# Altium schematic sheet 3V3_PSU.SchDoc
size A4
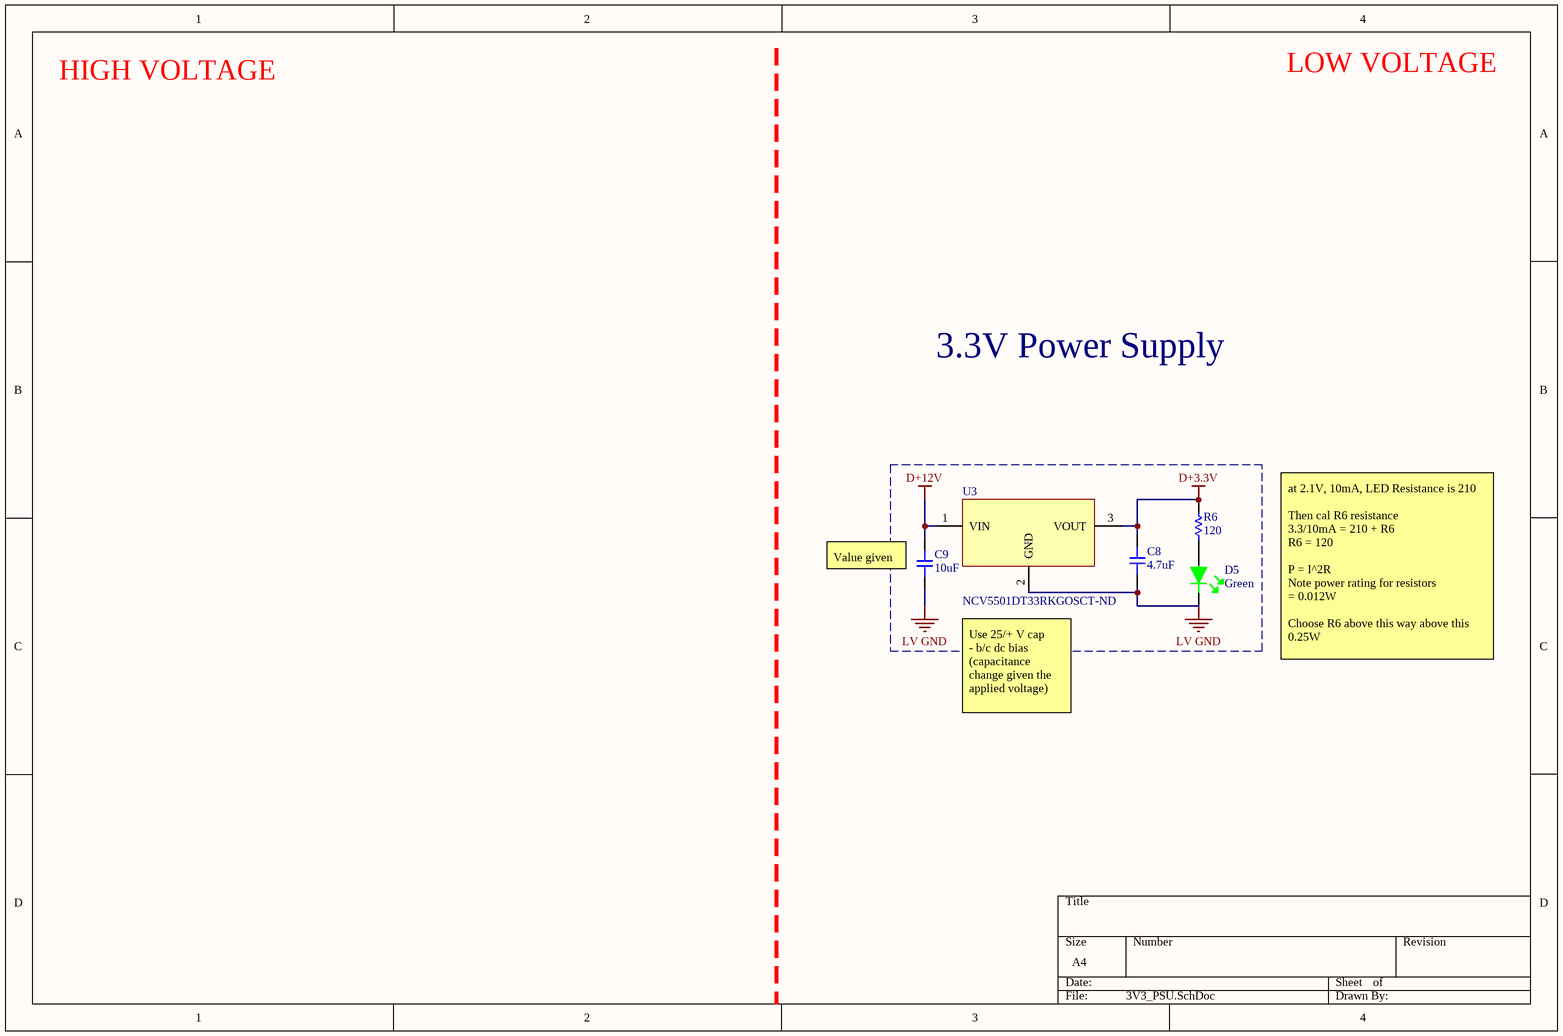
[diagram p0: 3V3_PSU.SchDoc]

## Parts
C8  4.7uF  [CAP-0805]
C9  10uF  [CAP-1206]
D5  Green  [LED-0603]
R6  120  [RESC1608X06N]
U3  NCV5501DT33RKGOSCT-ND  [DPAK-TO252]

## Nets
D+3.3V: C8.2 R6.2 U3.3(VOUT)
D+12V: C9.2 U3.1(VIN)
LV GND: C8.1 C9.1 D5.2 U3.2(GND)
NetD5_1: D5.1 R6.1

## Notes on the sheet
- HIGH VOLTAGE
- LOW VOLTAGE
- 3.3V Power Supply
- (near C9) Value given
- at 2.1V, 10mA, LED Resistance is 210
  Then cal R6 resistance
  3.3/10mA = 210 + R6
  R6 = 120
  P = I^2R
  Note power rating for resistors
  = 0.012W
  Choose R6 above this way above this
  0.25W
- Use 25/+ V cap
  - b/c dc bias (capacitance change given the applied voltage)

## Library data of the parts
C8 = 0805-4.7uF-16V: CAP CER 4.7UF 16V X5R 0805; Manufacturer: KEMET; Manufacturer Part Number: C0805C475K4PACTU; Dielectric Material: Ceramic; Tolerance: 10%; Supplier 1: Digi-Key; Stock 1: 96594; Pricing 1: 1=0.24, 10=0.168, 100=0.0951, 500=0.0671, 1000=0.05872 (USD); Mount: Surface Mount; Case/Package: 0805; Min Operating Temperature: -55°C; Max Operating Temperature: 85°C; Capacitance: 4.7uF; Packaging: Tape and Reel; Dielectric: X5R; Voltage: 16V; Termination: SMD/SMT; Voltage Rating (DC): 16V; Length: 2mm; Height: 1.25mm; Depth: 1.25mm; Radiation Hardening: No; Lead Free: Lead Free; ComponentLink1URL: http://capacitoredge.kemet.com/capedge2/DataSheet?pn=C0805C475K4PAC7800&src-supplier=Avnet+Europe; ComponentLink1Description: http://capacitoredge.kemet.com/capedge2/DataSheet?pn=C0805C475K4PAC7800&src-supplier=Avnet+Europe; ComponentLink2URL: https://www.verical.com/server-webapp/html/getDatasheet?partID=319476&src-supplier=Verical; ComponentLink2Description: https://www.verical.com/server-webapp/html/getDatasheet?partID=319476&src-supplier=Verical; Supplier Part Number 1: 399-8101-6-ND
C9 = 1206-10uF-50V: CAP CER 10UF 50V X5R 1206; Manufacturer: Murata; Manufacturer Part Number: GRT31CR61H106ME01L; Tolerance: 20%; Supplier 1: Digi-Key; Stock 1: 247205; Pricing 1: 1=0.5, 10=0.349, 100=0.2092, 500=0.1569, 1000=0.13249 (USD); Mount: Surface Mount; Case/Package: 1206; Case Code (Metric): 3216; Case Code (Imperial): 1206; Min Operating Temperature: -55°C; Max Operating Temperature: 85°C; Packaging: Tape and Reel; Capacitance: 10uF; Voltage Rating: 50V; Length: 0.126inch; Width: 0.063inch; Thickness: 0.071inch; Ratings: AEC-Q200; ComponentLink1URL: http://search.murata.co.jp/Ceramy/image/img/A01X/G101/ENG/GRT31CR61H106ME01-01.pdf?src-supplier=Digi-Key; ComponentLink1Description: http://search.murata.co.jp/Ceramy/image/img/A01X/G101/ENG/GRT31CR61H106ME01-01.pdf?src-supplier=Digi-Key; Supplier Part Number 1: 490-12457-1-ND
D5 = LED-Green: LED GREEN CLEAR 0603 SMD; Manufacturer: Wurth Electronics; Manufacturer Part Number: 150060VS75000; Luminous Intensity: 40mcd; Viewing Angle: 140°; Forward Voltage: 2V; Wavelength: 570nm; Lens Style: Clear,Rectangular; Forward Current: 30mA; Test Current: 20mA; Supplier 1: Digi-Key; Stock 1: 118118; Pricing 1: 1=0.14, 50=0.133, 100=0.114, 500=0.099 (USD); Mount: Surface Mount; Case/Package: 0603; Number of Pins: 2; Color: Green; Case Code (Metric): 1608; Case Code (Imperial): 0603; Min Operating Temperature: -40°C; Max Operating Temperature: 85°C; Package Quantity: 1; Packaging: Tape and Reel; Dominant Wavelength: 570nm; Length: 1.6mm; Height: 0.7mm; Width: 0.8mm; REACH SVHC: Unknown; ComponentLink1URL: https://katalog.we-online.de/led/datasheet/150060VS75000.pdf?src-supplier=Digi-Key; ComponentLink1Description: https://katalog.we-online.de/led/datasheet/150060VS75000.pdf?src-supplier=Digi-Key; Supplier Part Number 1: 732-4980-1-ND
R6 = ESR03EZPJ121: Res Thick Film 0603 120 Ohm 5% 0.25W(1/4W) ±200ppm/C Epoxy Resin Pad SMD Automotive T/R; Manufacturer: Rohm; Resistance: 120R; Power Rating: 250mW; Temperature Coefficient: 200ppm/°C; Supplier 1: Avnet; Manufacturer Part Number: ESR03EZPJ121; RoHS: Yes; Category: Chip SMD Resistors; Stock 1: 35000; Pricing 1: 5000=0.00936, 10000=0.00886, 20000=0.00835, 30000=0.00784, 40000=0.00734, 50000=0.00683, 500000=0.00633 (USD); Case/Package: 0603; Case Code (Metric): 1608; Case Code (Imperial): 0603; Size Code: 0603; Min Operating Temperature: -55°C; Max Operating Temperature: 155°C; Tolerance: 5%; Package Quantity: 1; Packaging: Tape and Reel; Resistor Type: Thick Film; Number of Terminations: 2; Max Power Dissipation: 250mW; Features: Automotive AEC-Q200; Series: ESR; Length: 0.063inch; Width: 0.031inch; Height: 0.022inch; Lead Free: Lead Free; RoHS Compliant: Yes; ComponentLink1URL: https://datasheet.ciiva.com/2495/esr-2495284.pdf?src-supplier=Digi-Key; ComponentLink1Description: https://datasheet.ciiva.com/2495/esr-2495284.pdf?src-supplier=Digi-Key; ComponentLink2URL: https://datasheet.ciiva.com/2495/esr-2495285.pdf?src-supplier=Digi-Key; ComponentLink2Description: https://datasheet.ciiva.com/2495/esr-2495285.pdf?src-supplier=Digi-Key; ComponentLink3URL: https://datasheet.ciiva.com/2495/esr-2495286.pdf?src-supplier=Digi-Key; ComponentLink3Description: https://datasheet.ciiva.com/2495/esr-2495286.pdf?src-supplier=Digi-Key; Supplier Part Number 1: ESR03EZPJ121
U3 = LDO-3.3V-500mA: IC REG LINEAR 3.3V 500MA DPAK; Manufacturer: ON Semiconductor; Min Input Voltage: 2.5V; Number of Outputs: 1; Max Input Voltage: 16V; Dropout Voltage: 230mV; Polarity: Positive; Accuracy: 2.9%; Output Type: Fixed; Supplier 1: Digi-Key; Manufacturer Part Number: NCV5501DT33RKG; Stock 1: 921; Pricing 1: 1=0.8, 10=0.7, 25=0.6576, 100=0.4984, 250=0.4242, 500=0.403, 1000=0.30755 (USD); Mount: Surface Mount; Case/Package: DPAK; Number of Pins: 3; Contact Plating: Tin,Matte; Min Operating Temperature: -40°C; Max Operating Temperature: 125°C; Output Voltage: 3.3V; Output Current: 500mA; Packaging: Tape and Reel; Max Output Current: 500mA; Package Quantity: 1; Number of Regulators: 1; Min Current Limit: 500mA; Min Output Voltage: 3.3V; Nominal Output Voltage: 3.3V; Output Voltage Accuracy: 2.9%; Length: 6.73mm; Height: 2.38mm; Width: 6.22mm; Radiation Hardening: No; REACH SVHC: No SVHC; Lead Free: Lead Free; ComponentLink1URL: http://www.onsemi.com/pub_link/Collateral/NCP5500-D.PDF?src-supplier=Future+Electronics; ComponentLink1Description: http://www.onsemi.com/pub_link/Collateral/NCP5500-D.PDF?src-supplier=Future+Electronics; ComponentLink2URL: http://www.onsemi.cn/pub_link/Collateral/NCP5500-D.PDF?src-supplier=Avnet; ComponentLink2Description: http://www.onsemi.cn/pub_link/Collateral/NCP5500-D.PDF?src-supplier=Avnet; ComponentLink3URL: http://www.onsemi.com/pub/Collateral/NCP5500-D.PDF?src-supplier=Avnet; ComponentLink3Description: http://www.onsemi.com/pub/Collateral/NCP5500-D.PDF?src-supplier=Avnet; ComponentLink4URL: http://www.onsemi.com/pub/Collateral/NCP5500-D.PDF?src-supplier=Digi-Key; ComponentLink4Description: http://www.onsemi.com/pub/Collateral/NCP5500-D.PDF?src-supplier=Digi-Key; Supplier Part Number 1: NCV5501DT33RKGOSDKR-ND